# EAGLE design pp_module_jack_rev_b (EAGLE 6.4)
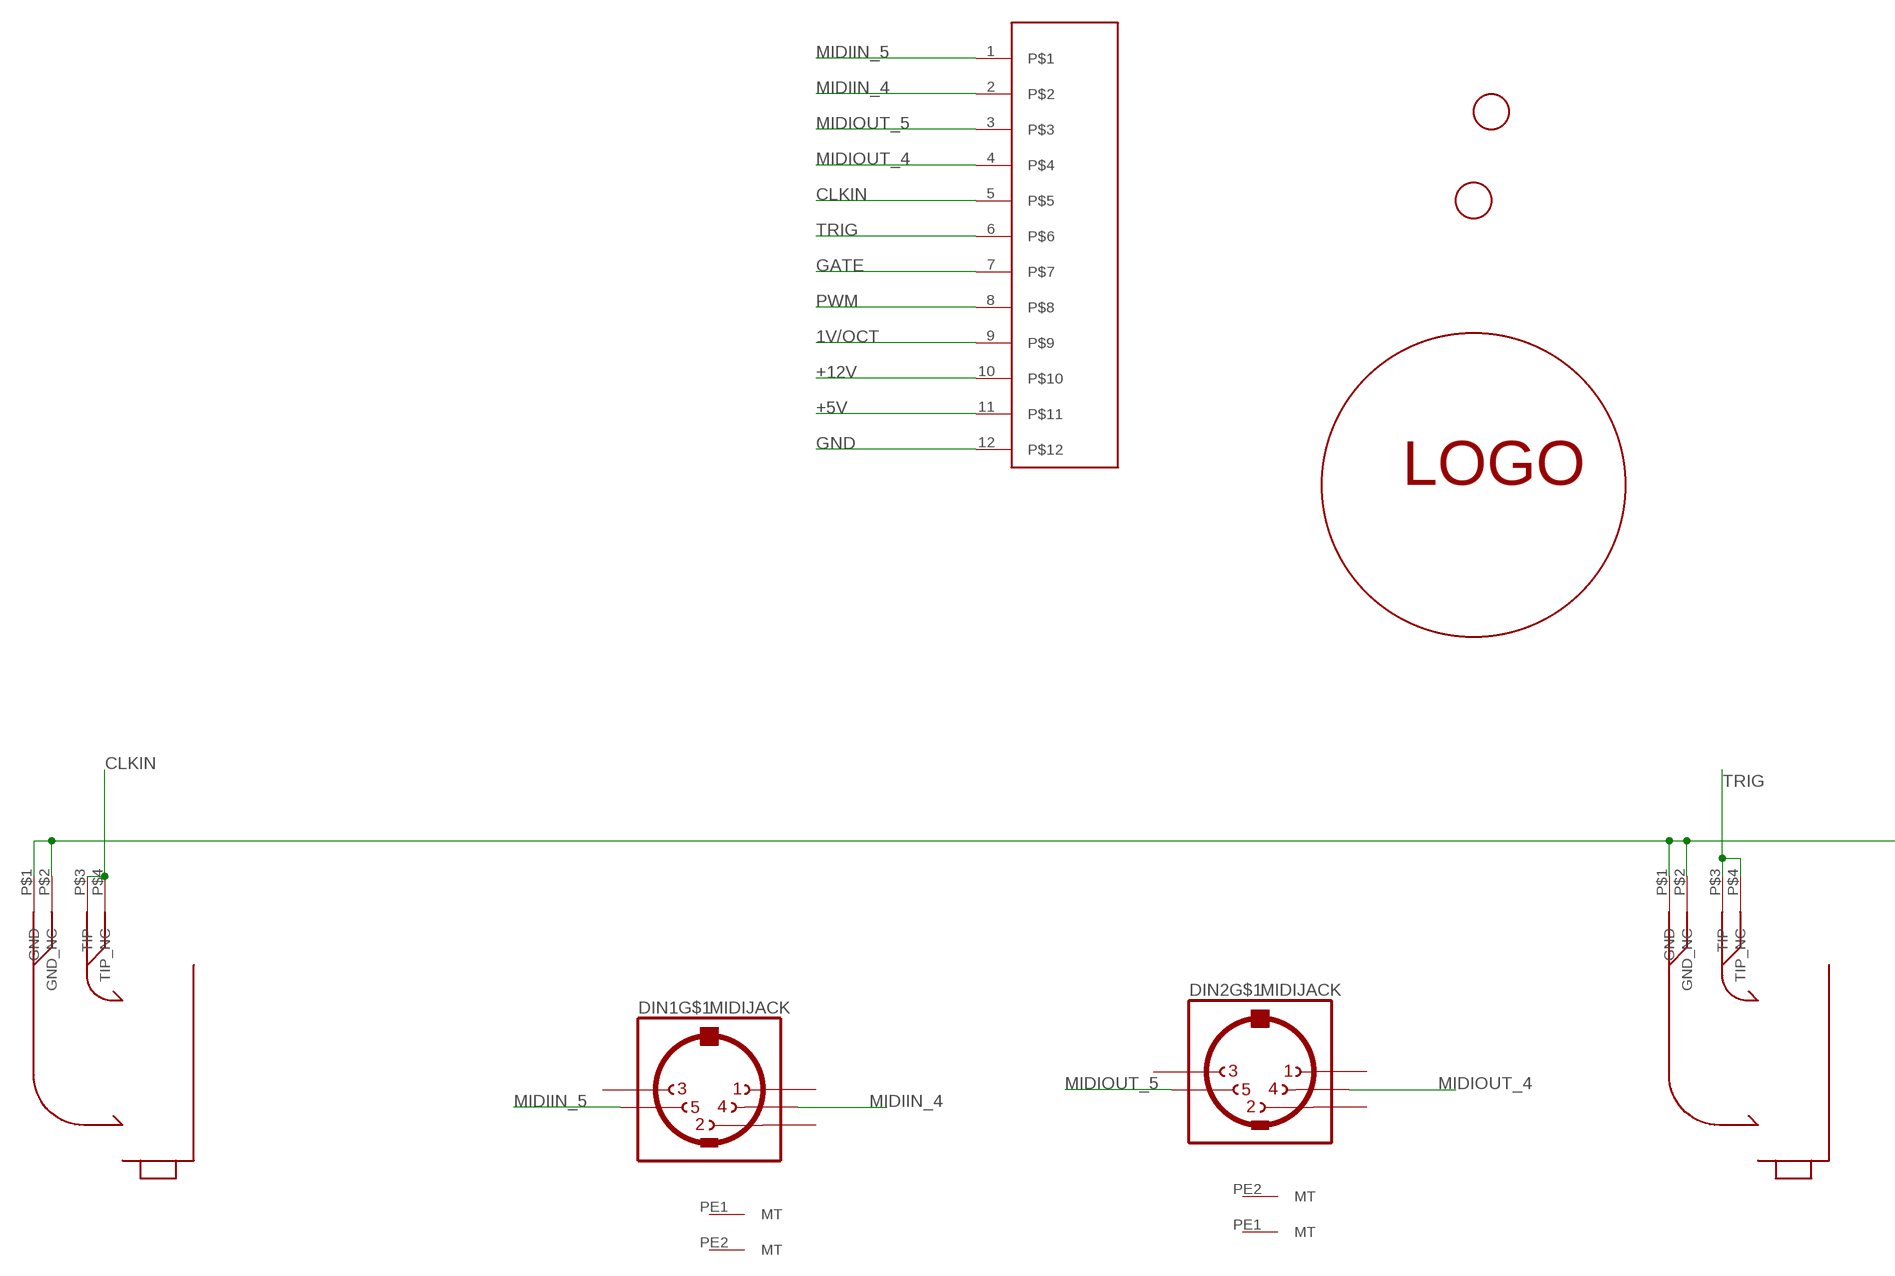
[diagram p0: schematic, sheet 1, part 1 of 2]
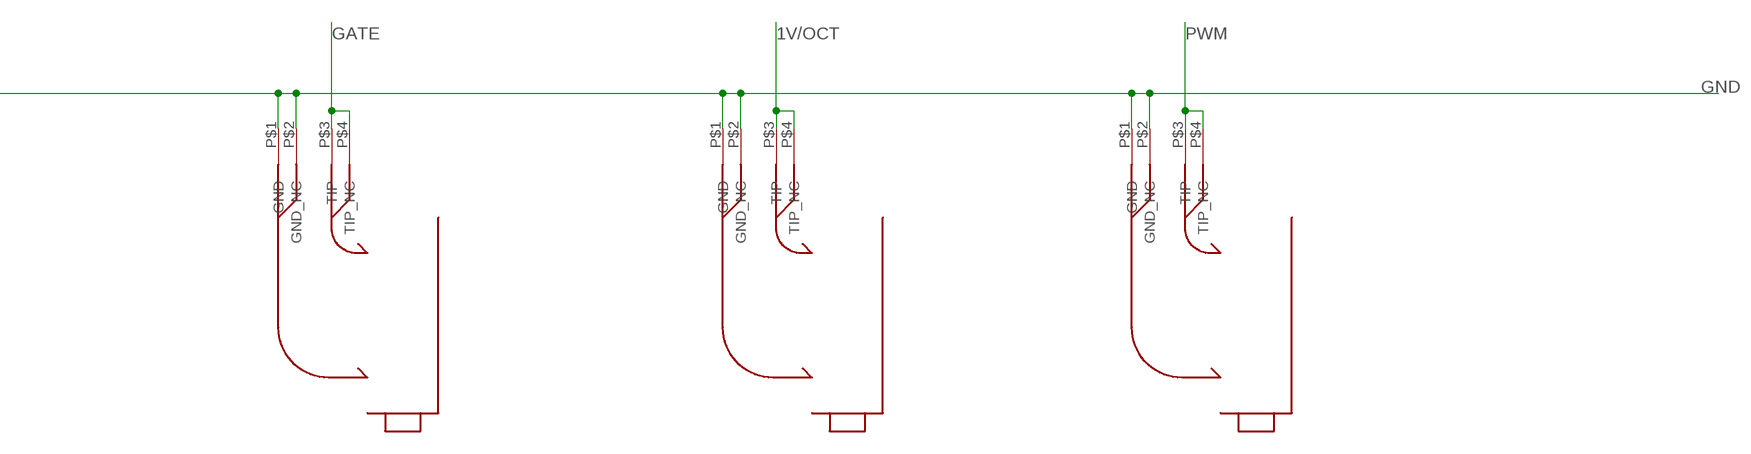
[diagram p1: schematic, sheet 1, part 2 of 2]

## Parts
DIN1  MIDIJACK  [CP-2350]
DIN2  MIDIJACK  [CP-2350]
J1  MONO_JACKCLIFF  [CLIFF_JACK]
J2  MONO_JACKCLIFF  [CLIFF_JACK]
J3  MONO_JACKCLIFF  [CLIFF_JACK]
J4  MONO_JACKCLIFF  [CLIFF_JACK]
J5  MONO_JACKCLIFF  [CLIFF_JACK]
SOCKET_1  CARDEDGE_12POS_SOCKET  [CARDEDGE_12POS_SOCKET]
U$1  FIDUCIAL  [FIDUCIAL_1MM]
U$2  FIDUCIAL  [FIDUCIAL_1MM]
U$10  LOGOCG  [LOGO-CG]

## Nets
1V/OCT: J4.P$3(TIP) J4.P$4(TIP_NC) SOCKET_1.9
+5V: SOCKET_1.11
+12V: SOCKET_1.10
CLKIN: J1.P$3(TIP) J1.P$4(TIP_NC) SOCKET_1.5
GATE: J3.P$3(TIP) J3.P$4(TIP_NC) SOCKET_1.7
GND: J1.P$1(GND) J1.P$2(GND_NC) J2.P$1(GND) J2.P$2(GND_NC) J3.P$1(GND) J3.P$2(GND_NC) J4.P$1(GND) J4.P$2(GND_NC) J5.P$1(GND) J5.P$2(GND_NC) SOCKET_1.12
MIDIIN_4: DIN1.4 SOCKET_1.2
MIDIIN_5: DIN1.5 SOCKET_1.1
MIDIOUT_4: DIN2.4 SOCKET_1.4
MIDIOUT_5: DIN2.5 SOCKET_1.3
PWM: J5.P$3(TIP) J5.P$4(TIP_NC) SOCKET_1.8
TRIG: J2.P$3(TIP) J2.P$4(TIP_NC) SOCKET_1.6
Unconnected: DIN1.1 DIN1.2 DIN1.3 DIN1.PE1(MT) DIN1.PE2(MT) DIN1.PE(MT) DIN1.PE@(MT) DIN2.1 DIN2.2 DIN2.3 DIN2.PE1(MT) DIN2.PE2(MT) DIN2.PE(MT) DIN2.PE@(MT)

## Library data of the parts
DIN1 DIN2 = osborn:MIDIJACK: DIN 5 jack also known as MIDI jack A modification of conn-hirshman:MAB5SH with two options for the grounding 'teeth'; CID: 172
J1-J5 = osborn:MONO_JACK; CID: 174
SOCKET_1 = osborn:CARDEDGE_12POS_SOCKET; CID: 176
U$1 U$2 = osborn:FIDUCIAL: For use by pick and place machines to calibrate the vision/machine, 1mm By microbuilder.eu
U$10 = osborn:LOGO

## Board
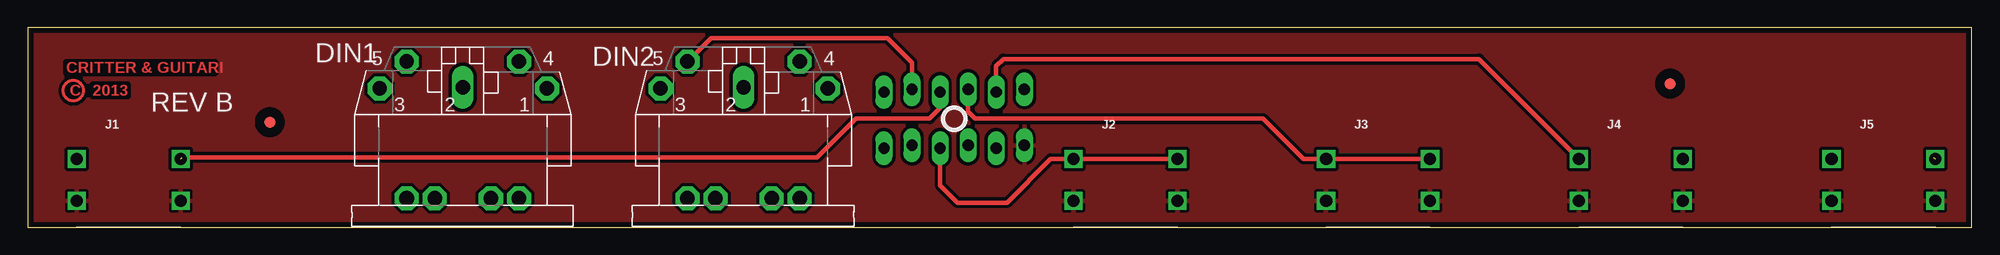
[diagram p2: board, top side]
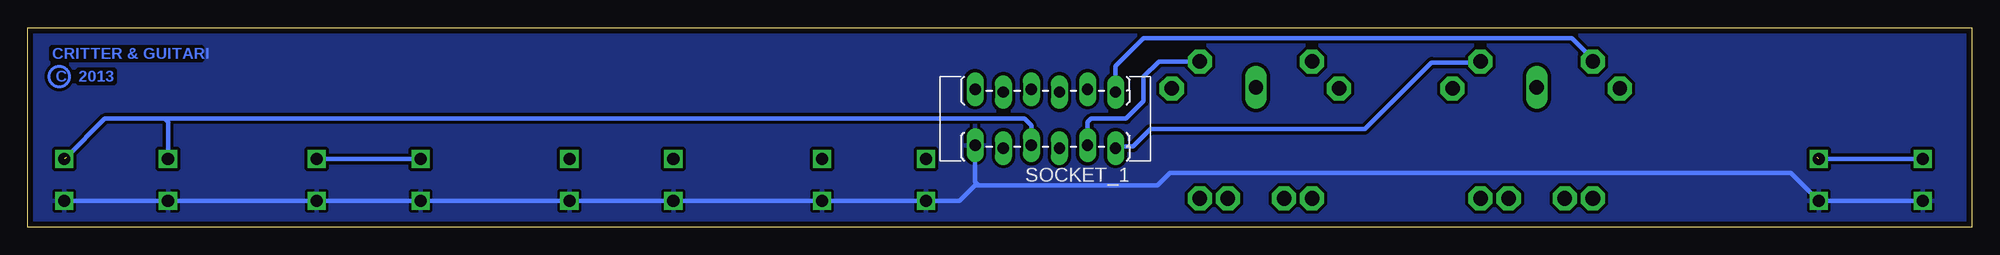
[diagram p3: board, bottom side, seen from below]

Size 175.9 x 18.1 mm. Coordinates in mm from the lower left corner, seen from the top.
Outline: 0,0 175.9,0 175.9,18.1 0,18.1 0,0
Copper layers (1*16): Top 0.035mm / dielectric 1.5mm / Bottom 0.035mm
Design rules "default": minimum track width 10mil, minimum drill 24mil, track to track 10mil, track to pad 10mil, pad to pad 10mil, via to via 10mil, smd to smd 10mil, copper to edge 20mil, drill to drill 8mil, minimum pad ring 10mil, minimum via ring 8mil, stop-mask expansion 4mil, vias tented up to drill 0mil, thermal gap 10mil

### Footprints (pad centres in the part's own frame; a part is rotated, then mirrored left to right if it is on the bottom)
CP-2350 = drill 1.3 pad 2.184 octagon: 1 7.62,12.58; 3 -7.52,12.58; 4 5.08,15.02; 5 -5.08,15.02 | drill 1.3 long: 2 0,12.68 | drill 1.321 pad 2.184 octagon: PE -2.54,2.62; PE1 -5.08,2.62; PE2 5.08,2.62; PE@ 2.54,2.62
CLIFF_JACK = drill 1.1 square: P$1 -4.445,-2.045; P$2 4.955,-2.045; P$3 -4.445,1.755; P$4 4.955,1.755
CARDEDGE_12POS_SOCKET = drill 1.016 long: 1 -6.35,-2.413; 2 -6.35,2.667; 3 -3.81,-2.667; 4 -3.81,2.413; 5 -1.27,-2.413; 6 -1.27,2.667; 7 1.27,-2.667; 8 1.27,2.413; 9 3.81,-2.413; 10 3.81,2.667; 11 6.35,-2.667; 12 6.35,2.413
FIDUCIAL_1MM = smd 1 x 1: 1 0,0

### Placement (x,y rotation side)
DIN1  39.37,0 0 top
DIN2  64.77,0 0 top
J1  8.89,4.45 0 top
J2  99.06,4.45 0 top
J3  121.92,4.45 0 top
J4  144.78,4.45 0 top
J5  167.64,4.45 0 top
SOCKET_1  83.82,9.84 180 bottom
U$1  21.91,9.53 0 top
U$2  148.59,13.02 0 top
U$9  LOGOCG  [LOGO-CG]  15.56,13.97 0 top
U$10  161.61,15.24 0 bottom

### Tracks (layer width: path | path; a pad name or v marks a point on that pad's centre or on a via)
1V/OCT
  Top 0.406: SOCKET_1.9 87.63,14.61 88.27,15.24 131.31,15.24 131.31,15.23 J4.P$3
  Bottom 0.406: J4.P$4 J4.P$3
CLKIN  (1 unrouted)
  Top 0.406: SOCKET_1.5 82.55,10.79 81.6,9.84 74.93,9.84 71.44,6.35 13.98,6.35
  Bottom 0.406: J1.P$3 J1.P$4
GATE
  Top 0.406: SOCKET_1.7 85.09,10.48 85.72,9.84 111.76,9.84 115.4,6.2 J3.P$3 J3.P$4
GND
  Bottom 0.406: 89.85,3.81 73.66,3.81 72.54,4.93 16.38,4.93 J1.P$2 J1.P$1 | 89.85,3.81 90.17,3.81 91.59,2.39 94.61,2.39 J2.P$1 J2.P$2 J3.P$1 J3.P$2 J4.P$1 J4.P$2 163.02,2.4 163.51,1.91 163.51,2.08 J5.P$1 J5.P$2 | SOCKET_1.12 90.17,4.13 89.85,3.81
  pour Top (isolate 0.305): 0.32,17.78 175.58,17.78 175.58,0.32 0.32,0.32
  pour Bottom (isolate 0.305): 0.32,17.78 175.58,17.78 175.58,0.32 0.32,0.32
MIDIIN_4
  Bottom 0.406: SOCKET_1.2 77.34,7.3 75.88,7.3 74.3,8.89 54.93,8.89 48.9,14.92 44.55,14.92 DIN1.4
MIDIIN_5
  Bottom 0.406: SOCKET_1.1 77.47,14.61 74.93,17.14 36.2,17.14 34.29,15.24 DIN1.5
MIDIOUT_4
  Bottom 0.406: DIN2.4 73.56,15.02 74.93,13.65 74.93,11.43 76.52,9.84 79.69,9.84 80.01,9.53 SOCKET_1.4
MIDIOUT_5
  Top 0.406: SOCKET_1.3 80.01,14.92 77.79,17.14 61.81,17.14 DIN2.5
PWM  (1 unrouted)
  Bottom 0.406: SOCKET_1.8 85.09,9.21 85.72,9.84 163.51,9.84 | 163.51,9.84 168.91,9.84 172.4,6.33 | J5.P$3 163.19,9.53 163.51,9.84
TRIG
  Top 0.406: SOCKET_1.6 82.55,3.81 84.14,2.22 88.58,2.22 92.56,6.2 J2.P$3 J2.P$4

### Text on the board
tPlace: REV B